# Altium schematic sheet ReferenceVoltage.SchDoc: Precision, low drift, 2.5V Reference Voltage
size A4; Date: 30.05.2015; Author: G. Gajoch, M. Gumiela; DocumentNumber: 3; SheetNumber: 3; SheetTotal: 9; Model: EM1; PageSetup: Record=PageOptions|CenterHorizontal=True|CenterVertical=True|PrintScale=0.52|XCorrection=1.00|YCorrection=1.00|PrintKind=1|BorderSize=5000000|LeftOffset=0|BottomOffset=0|Orientation=2|PaperLength=4200|PaperWidth=2970|Scale=100|PaperSource=7|PrintQuality=600|MediaType=1|DitherType=10|PaperKind=A3|PrintScaleMode=1
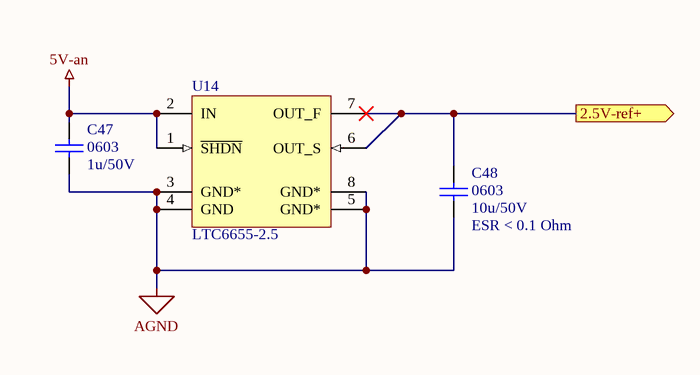
[diagram p0: ReferenceVoltage.SchDoc]

## Parts
C47  0603  value 1u/50V  [SMD_Capacitor_0603]
C48  ESR < 0.1 Ohm  value 10u/50V  [SMD_Capacitor_0603]
U14  LTC6655-2.5  [MSOP-8]

## Ports
2.5V-ref+ (out)

## Nets
5V-an: C47.2 U14.1(~{SHDN}) U14.2(IN)
AGND: C47.1 C48.1 U14.3(GND*) U14.4(GND) U14.5(GND*) U14.8(GND*)
2.5V-ref+: C48.2 U14.6(OUT_S) U14.7(OUT_F) ; port 2.5V-ref+

## Notes on the sheet
- Title:
- Sheet:
- of
- Author:
- Model:
- Document Number:
- Checked by:
- Iss-Rev:
- Approved by:
- Date:
- File name:

## Library data of the parts
C47 C48 = Cap: Capacitor; Published: 8-Jun-2000; LatestRevisionDate: 17-Jul-2002; LatestRevisionNote: Re-released for DXP Platform.; PackageReference: RAD-0.3; Publisher: Altium Limited; PackageDescription: Radial Cap, Thru-Hole; 2 Leads; 0.3 in Pin Spacing
U14 = LTC6655-2.5: 0.25ppm Noise, Low Drift  Precision References; PartNumber: LTC6655-2.5; ComponentLink1Description: Manufacturer URL; ComponentLink1URL: http://www.linear.com/; ComponentLink2Description: Datasheet; ComponentLink2URL: http://cds.linear.com/docs/en/datasheet/6655fe.pdf